# EAGLE design Dual_H-bridge1 (EAGLE 7.2.0)
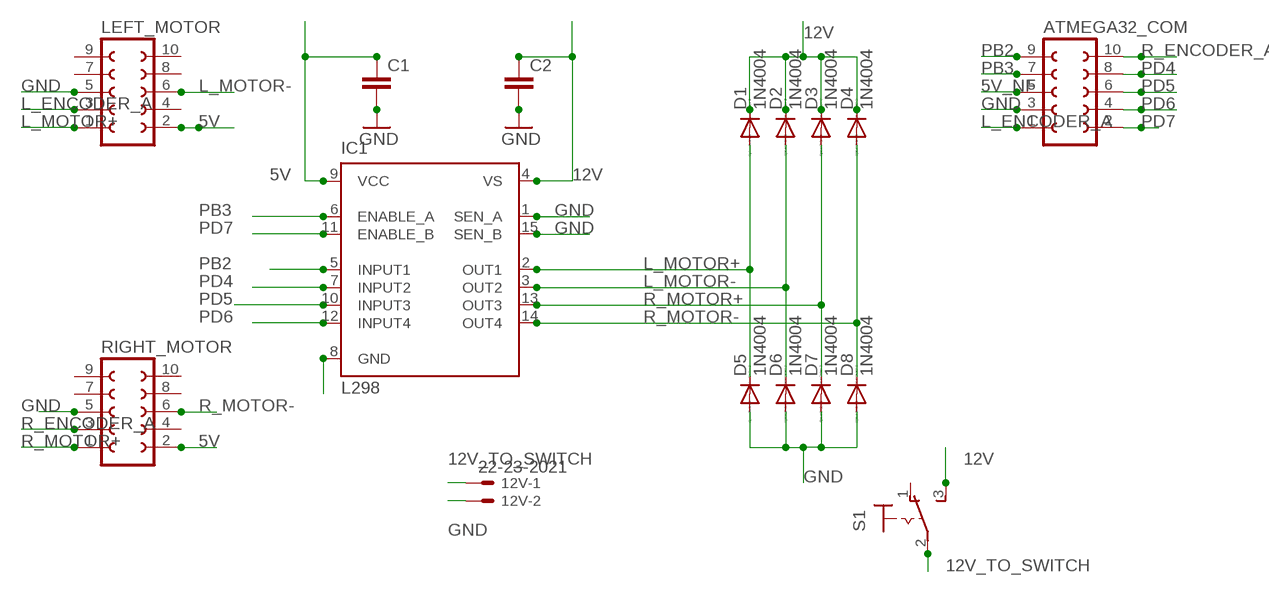
[diagram p0: schematic, sheet 1]

## Parts
12V  22-23-2021  [22-23-2021]
ATMEGA32_COM  FE05-2  [FE05-2]
C1  C5/3  [C5B3]
C2  C5/3  [C5B3]
D1  1N4004  [DO41-10]
D2  1N4004  [DO41-10]
D3  1N4004  [DO41-10]
D4  1N4004  [DO41-10]
D5  1N4004  [DO41-10]
D6  1N4004  [DO41-10]
D7  1N4004  [DO41-10]
D8  1N4004  [DO41-10]
IC1  L298  [MULTIWATT-15]
LEFT_MOTOR  FE05-2  [FE05-2]
RIGHT_MOTOR  FE05-2  [FE05-2]
S1  M9040P  [M9040P]

## Nets
5V: C1.1 IC1.9(VCC) LEFT_MOTOR.2 RIGHT_MOTOR.2
5V_NF: ATMEGA32_COM.5
12V: C2.1 D1.C D2.C D3.C D4.C IC1.4(VS) S1.3(S)
12V_TO_SWITCH: 12V.1 S1.2(P)
GND: 12V.2 ATMEGA32_COM.3 C1.2 C2.2 D5.A D6.A D7.A D8.A IC1.1(SEN_A) IC1.8(GND) IC1.15(SEN_B) LEFT_MOTOR.5 RIGHT_MOTOR.5
L_ENCODER_A: ATMEGA32_COM.1 LEFT_MOTOR.3
L_MOTOR+: D1.A D5.C IC1.2(OUT1) LEFT_MOTOR.1
L_MOTOR-: D2.A D6.C IC1.3(OUT2) LEFT_MOTOR.6
PB2: ATMEGA32_COM.9 IC1.5(INPUT1)
PB3: ATMEGA32_COM.7 IC1.6(ENABLE_A)
PD4: ATMEGA32_COM.8 IC1.7(INPUT2)
PD5: ATMEGA32_COM.6 IC1.10(INPUT3)
PD6: ATMEGA32_COM.4 IC1.12(INPUT4)
PD7: ATMEGA32_COM.2 IC1.11(ENABLE_B)
R_ENCODER_A: ATMEGA32_COM.10 RIGHT_MOTOR.3
R_MOTOR+: D3.A D7.C IC1.13(OUT3) RIGHT_MOTOR.1
R_MOTOR-: D4.A D8.C IC1.14(OUT4) RIGHT_MOTOR.6
Unconnected: LEFT_MOTOR.4 LEFT_MOTOR.7 LEFT_MOTOR.8 LEFT_MOTOR.9 LEFT_MOTOR.10 RIGHT_MOTOR.4 RIGHT_MOTOR.7 RIGHT_MOTOR.8 RIGHT_MOTOR.9 RIGHT_MOTOR.10 S1.1(O)

## Library data of the parts
12V = con-molex:22-23-2021: .100" (2.54mm) Center Header - 2 Pin; MF: MOLEX; MPN: 22-23-2021; OC_FARNELL: 1462926; OC_NEWARK: 25C3832
ATMEGA32_COM LEFT_MOTOR RIGHT_MOTOR = con-lsta:FE05-2: FEMALE HEADER; OC_FARNELL: unknown; OC_NEWARK: unknown
C1 C2 = capacitor-wima:C: CAPACITOR naming: grid - package width
D1-D8 = diode:1N4004: DIODE general purpose rectifier, 1 A
IC1 = st-microelectronics:L298: DUAL FULL-BRIDGE DRIVER; MPN: L298N; OC_FARNELL: 1589425; OC_NEWARK: 32M1527
S1 = switch:M9040P: TOGGLE SWITCH Marquardt

## Board
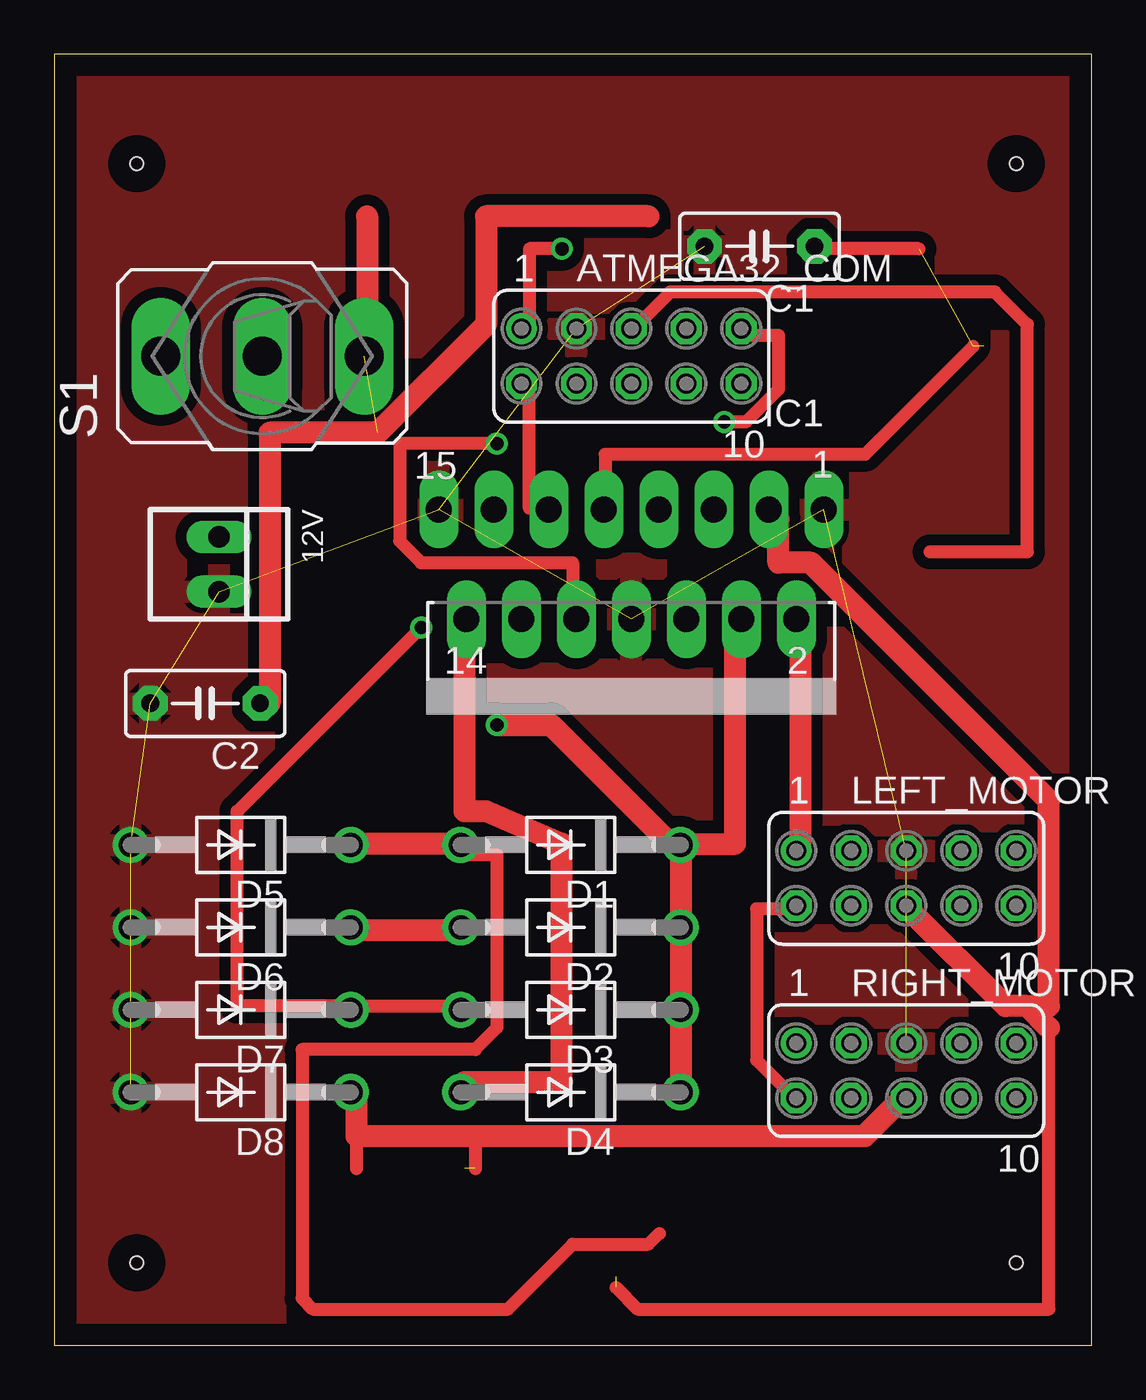
[diagram p1: board, top side]
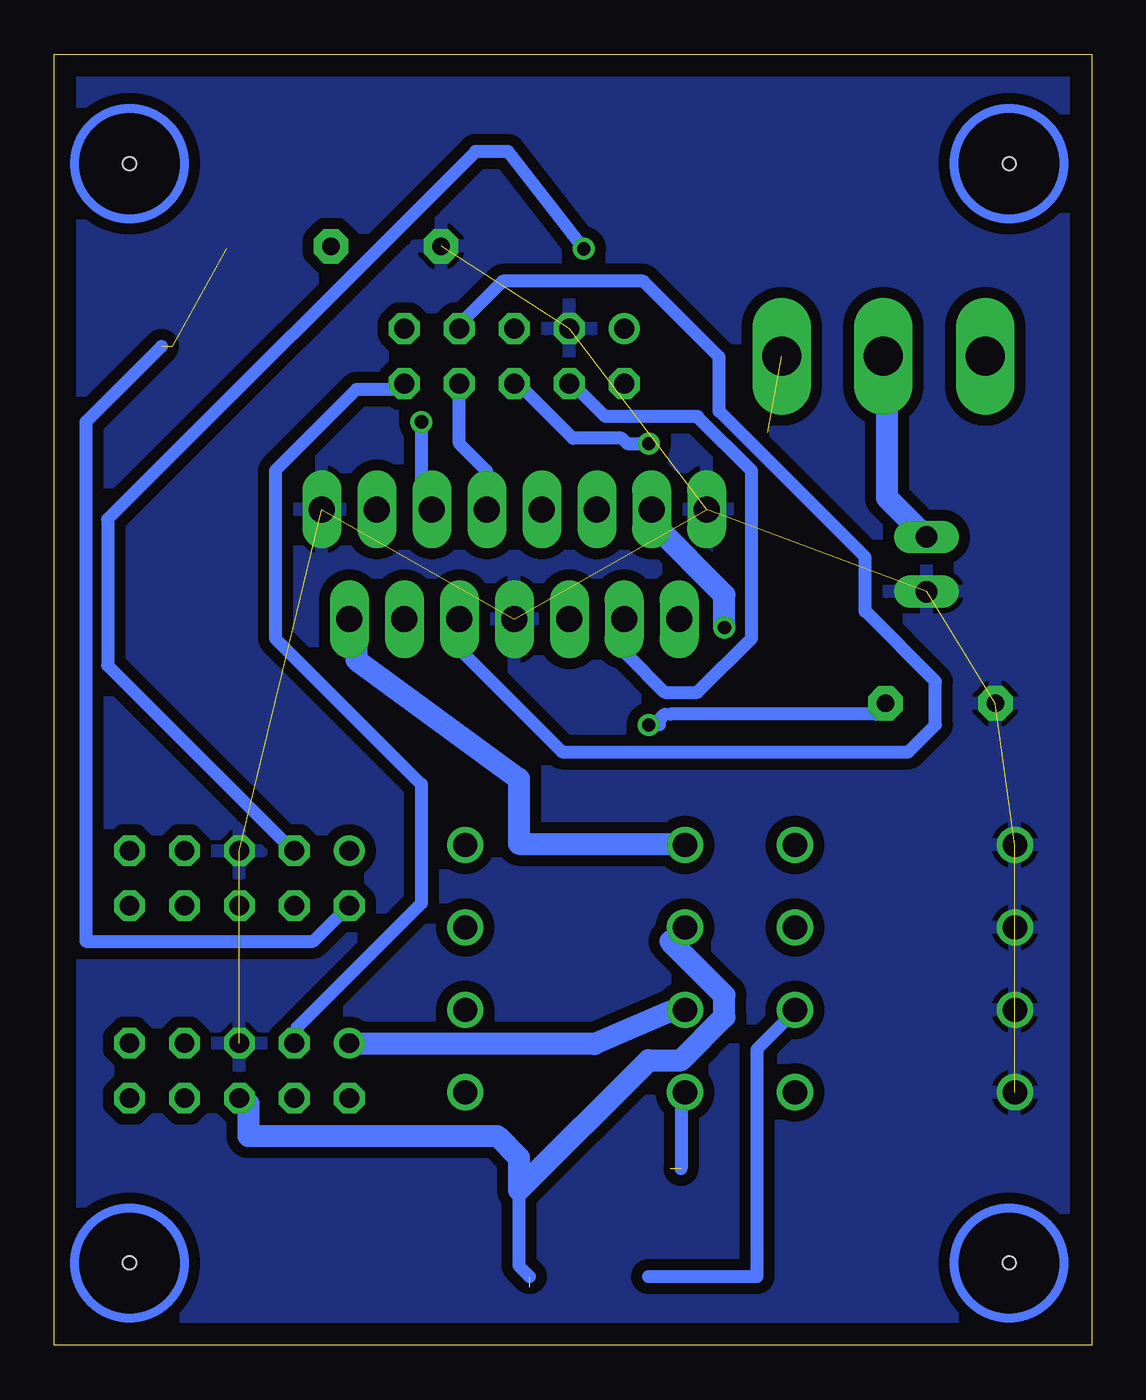
[diagram p2: board, bottom side, seen from below]

Size 47.93 x 59.68 mm. Coordinates in mm from the lower left corner, seen from the top.
Outline: 0,0 47.93,0 47.93,59.68 0,59.68 0,0
Copper layers (1*16): Top 0.035mm / dielectric 1.5mm / Bottom 0.035mm
Design rules "default *": minimum track width 10mil, minimum drill 24mil, track to track 20mil, track to pad 20mil, pad to pad 20mil, via to via 20mil, smd to smd 20mil, copper to edge 40mil, drill to drill 8mil, minimum pad ring 10mil, minimum via ring 8mil, stop-mask expansion 4mil, vias tented up to drill 0mil, thermal gap 10mil
Holes 0.6 mm at 3.81,54.61 44.45,3.81 3.81,3.81 44.45,54.61

### Footprints (pad centres in the part's own frame; a part is rotated, then mirrored left to right if it is on the bottom)
22-23-2021 = drill 1 long: 1 -1.27,0; 2 1.27,0
FE05-2 = drill 0.914: 1 -5.08,1.27 | drill 0.914 octagon: 2 -5.08,-1.27; 3 -2.54,1.27; 4 -2.54,-1.27; 5 0,1.27; 6 0,-1.27; 7 2.54,1.27; 8 2.54,-1.27; 9 5.08,1.27; 10 5.08,-1.27
C5B3 = drill 0.813 pad 1.6 octagon: 1 -2.54,0; 2 2.54,0
DO41-10 = drill 1.118: A 5.08,0; C -5.08,0
MULTIWATT-15 = drill 1.2 long: 1 -8.89,-7.62; 2 -7.62,-2.54; 3 -6.35,-7.62; 4 -5.08,-2.54; 5 -3.81,-7.62; 6 -2.54,-2.54; 7 -1.27,-7.62; 8 0,-2.54; 9 1.27,-7.62; 10 2.54,-2.54; 11 3.81,-7.62; 12 5.08,-2.54; 13 6.35,-7.62; 14 7.62,-2.54; 15 8.89,-7.62
M9040P = drill 1.803 long: 1 0,4.699; 2 0,0; 3 0,-4.699

### Placement (x,y rotation side)
12V  7.62,36.1 270 top
ATMEGA32_COM  26.67,45.72 0 top
C1  32.59,50.8 180 top
C2  6.98,29.67 180 top
D1  23.86,23.13 180 top
D2  23.86,19.32 180 top
D3  23.86,15.51 180 top
D4  23.86,11.7 180 top
D5  8.62,23.13 180 top
D6  8.62,19.32 180 top
D7  8.62,15.51 180 top
D8  8.62,11.7 180 top
IC1  26.67,31.02 180 top
LEFT_MOTOR  39.37,21.59 0 top
RIGHT_MOTOR  39.37,12.7 0 top
S1  9.62,45.72 90 top

### Tracks (layer width: path | path; a pad name or v marks a point on that pad's centre or on a via)
5V  (2 unrouted)
  Top 0.254: 25.46,38.68 IC1.9
  Top 0.61: RIGHT_MOTOR.2 33.96,11.68 32.46,13.18 32.46,20.18 33.96,20.18 LEFT_MOTOR.2 | 39.96,50.68 35.46,50.68 C1.1 | 25.46,38.68 25.46,41.18 37.46,41.18 42.46,46.18
  Bottom 0.254: 34.21,20.43 LEFT_MOTOR.2
  Bottom 0.61: 42.96,46.18 46.46,42.68 46.46,18.68 35.96,18.68 34.46,20.18 LEFT_MOTOR.2
5V_NF
  Top 0.254: 26.96,47.18 ATMEGA32_COM.5
  Top 0.61: 26.96,47.18 28.46,48.68 43.46,48.68 44.96,47.18 44.96,36.68 40.46,36.68
12V  (via drill 0.61)  (1 unrouted)
  Top 0.254: 28.96,15.18 D3.C 28.96,15.68 | 28.96,19.68 D2.C 28.96,19.18 | 28.96,23.18 D1.C 28.46,23.18 | 14.46,46.18 S1.3
  Top 1.016: 28.96,15.18 28.96,12.18 D4.C | 28.96,19.68 28.96,22.68 D1.C | 28.96,23.18 31.46,23.18 31.46,33.18 IC1.4 | 28.96,19.18 28.96,15.68 | 27.46,52.18 19.96,52.18 19.96,47.18 14.96,42.18 9.96,42.18 9.96,29.68 C2.1 | 28.46,23.18 22.96,28.68 v20.46,28.68 | 14.46,52.18 14.46,46.18
  Bottom 0.254: 19.71,29.18 19.46,29.18 19.96,28.68
  Bottom 0.61: 19.71,29.18 20.21,28.68 | 19.46,29.18 9.96,29.18 9.71,29.43 C2.1 | 19.96,28.68 v20.46,28.68
12V_TO_SWITCH
  Bottom 0.254: 9.46,45.68 S1.2
  Bottom 1.016: 9.46,45.68 9.46,39.18 7.96,37.68 12V.1
GND  (12 unrouted)
  pour Bottom: 0,0 0,59.69 48.26,59.69 48.26,0
  pour Top: 0.46,59.68 48.46,59.68 48.46,0.68 48.46,-0.32 -0.54,-0.32 -0.54,59.68
L_ENCODER_A  (via drill 0.61)
  Top 0.61: v23.46,50.68 21.96,50.68 21.96,47.18 ATMEGA32_COM.1
  Bottom 0.254: 36.96,22.93 LEFT_MOTOR.3
  Bottom 0.61: 36.96,22.93 45.46,31.43 45.46,38.18 28.46,55.18 26.96,55.18 v23.46,50.68
L_MOTOR+
  Top 0.254: 34.46,33.18 IC1.2 | 13.96,23.18 D5.C | 18.46,23.18 D1.A 18.96,22.68
  Top 0.61: 27.96,5.18 27.46,4.68 23.96,4.68 20.96,1.68 11.96,1.68 11.46,2.18 11.46,13.68 19.46,13.68 20.46,14.68 20.46,22.68 18.96,22.68
  Top 1.016: 34.46,33.18 34.46,23.18 LEFT_MOTOR.1 | 18.46,23.18 13.96,23.18
  Bottom 0.254: 18.96,22.93 D1.A 18.96,23.18
  Bottom 1.016: 18.96,23.18 26.46,23.18 26.46,26.18 33.96,31.68 33.96,33.18 IC1.2
L_MOTOR-  (1 unrouted)
  Top 0.254: 39.46,20.18 LEFT_MOTOR.6
  Top 0.61: 45.96,14.68 45.96,1.68 26.96,1.68 25.96,2.68
  Top 1.016: 39.46,20.18 43.96,15.68 44.96,15.68 | 45.96,14.68 44.96,15.68 | D6.C 13.96,19.18 18.46,19.18 D2.A | 44.96,15.68 45.96,15.68 45.96,25.18 34.96,36.18 33.46,36.18 33.46,38.18 IC1.3
  Bottom 0.254: 19.46,18.68 18.96,19.18
  Bottom 0.61: 25.96,3.18 26.46,3.68 26.46,7.18
  Bottom 1.016: 18.96,19.18 D2.A | 38.96,11.18 38.96,9.68 27.46,9.68 26.46,8.68 26.46,7.18 20.46,13.18 18.96,13.18 16.96,15.18 16.96,16.18 19.46,18.68
PB2  (via drill 0.61)
  Top 0.61: v30.96,42.68 31.96,42.68 33.46,44.18 33.46,46.68 31.96,46.68 ATMEGA32_COM.9
  Bottom 0.61: v30.96,42.68 30.96,38.68 IC1.5
PB3
  Bottom 0.61: IC1.6 29.21,32.18 24.46,27.43 8.46,27.43 7.21,28.68 7.21,30.68 10.46,33.93 10.46,36.43 17.21,43.18 17.21,45.68 20.71,49.18 27.21,49.18 29.21,47.18 ATMEGA32_COM.7
PD4
  Bottom 0.254: 27.96,38.68 IC1.7
  Bottom 0.61: ATMEGA32_COM.8 29.21,41.68 27.96,40.43 27.96,38.68
PD5  (via drill 0.61)
  Top 0.254: 23.96,33.68 IC1.10
  Top 0.61: 23.96,33.68 23.96,36.18 16.96,36.18 15.96,37.18 15.96,41.68 v20.46,41.68
  Bottom 0.61: ATMEGA32_COM.6 26.46,44.43 23.96,41.93 21.71,41.93 21.46,41.68 v20.46,41.68
PD6
  Bottom 0.254: 23.96,44.43 ATMEGA32_COM.4 | 21.46,33.43 IC1.12
  Bottom 0.61: 23.96,44.43 22.46,42.93 18.21,42.93 15.71,40.43 15.71,32.68 18.21,30.18 19.71,30.18 21.46,31.93 21.46,33.43
PD7
  Top 0.254: 22.46,38.68 21.96,38.68
  Top 0.61: 21.96,38.68 21.96,44.18 ATMEGA32_COM.2 | 22.46,38.68 IC1.11
R_ENCODER_A
  Bottom 0.254: 36.71,14.68 36.71,14.18 | 31.96,44.43 ATMEGA32_COM.10
  Bottom 0.61: 36.71,14.68 30.96,20.43 30.96,25.93 37.71,32.68 37.71,40.43 33.96,44.18 32.21,44.18 31.96,44.43 | 36.71,14.18 RIGHT_MOTOR.3
R_MOTOR+  (via drill 0.61)
  Top 0.254: 13.46,15.68 D7.C 13.96,15.68
  Top 0.61: v16.96,33.18 8.46,24.68 8.46,15.68 13.46,15.68 | 13.96,15.68 18.46,15.68 D3.A
  Bottom 0.254: 18.96,15.43 19.46,15.43 | 34.21,13.93 RIGHT_MOTOR.1 | 20.21,37.93 20.21,38.43
  Bottom 0.61: 20.46,3.18 15.46,3.18 15.46,13.68 13.96,15.18 D7.C
  Bottom 1.016: 34.21,13.93 22.96,13.93 19.46,15.43 | 18.96,15.43 D3.A | 20.21,37.93 16.96,34.68 v16.96,33.18 | 20.21,38.43 IC1.13
R_MOTOR-  (1 unrouted)
  Top 0.254: 13.96,11.68 D8.C
  Top 0.61: 13.96,9.68 13.96,8.18 | 19.46,9.68 19.46,8.18
  Top 1.016: IC1.14 18.96,33.18 18.96,24.68 19.96,24.68 23.46,23.18 23.46,12.18 18.96,12.18 D4.A | 13.96,11.68 13.96,9.68 19.46,9.68 37.46,9.68 38.96,11.18 RIGHT_MOTOR.6
  Bottom 0.254: 18.96,11.68 D4.A
  Bottom 0.61: 18.96,11.68 18.96,8.18
(copper drawn outside any net)
  shapes: Bottom circle x4